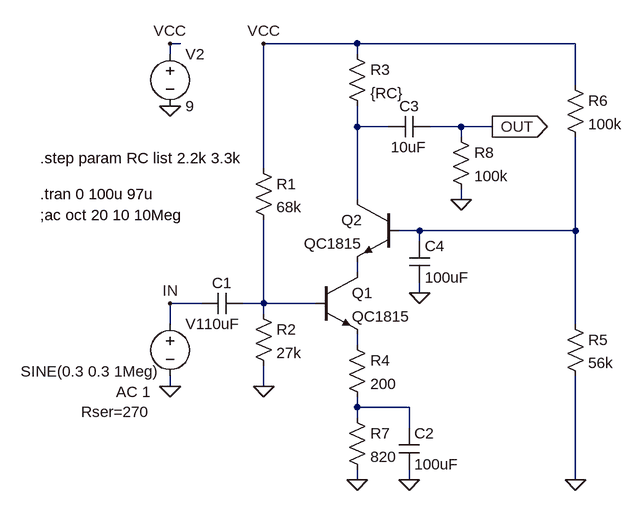
[diagram p0: schematic BaseCommon_Cascode.asc]
BaseCommon_Cascode.asc, the LTspice schematic file:
Version 4
SHEET 1 1048 704
WIRE 80 -64 64 -64
WIRE 352 -64 208 -64
WIRE 688 -64 352 -64
WIRE 64 -48 64 -64
WIRE 352 -48 352 -64
WIRE 688 0 688 -64
WIRE 352 64 352 32
WIRE 400 64 352 64
WIRE 512 64 464 64
WIRE 560 64 512 64
WIRE 512 80 512 64
WIRE 208 128 208 -64
WIRE 352 176 352 64
WIRE 512 176 512 160
WIRE 448 224 416 224
WIRE 688 224 688 80
WIRE 688 224 448 224
WIRE 448 240 448 224
WIRE 352 288 352 272
WIRE 448 320 448 304
WIRE 112 336 64 336
WIRE 208 336 208 208
WIRE 208 336 176 336
WIRE 288 336 208 336
WIRE 208 352 208 336
WIRE 64 368 64 336
WIRE 688 368 688 224
WIRE 352 400 352 384
WIRE 64 464 64 448
WIRE 208 464 208 432
WIRE 352 496 352 480
WIRE 432 496 352 496
WIRE 352 512 352 496
WIRE 432 528 432 496
WIRE 352 608 352 592
WIRE 432 608 432 592
WIRE 688 608 688 448
FLAG 432 608 0
FLAG 208 464 0
FLAG 688 608 0
FLAG 64 464 0
FLAG 64 336 IN
FLAG 560 64 OUT
IOPIN 560 64 Out
FLAG 64 32 0
FLAG 64 -64 VCC
FLAG 208 -64 VCC
FLAG 448 320 0
FLAG 352 608 0
FLAG 512 176 0
SYMBOL npn 416 176 M0
SYMATTR InstName Q2
SYMATTR Value QC1815
SYMBOL res 192 112 R0
SYMATTR InstName R1
SYMATTR Value 68k
SYMBOL res 192 336 R0
SYMATTR InstName R2
SYMATTR Value 27k
SYMBOL cap 416 528 R0
SYMATTR InstName C2
SYMATTR Value 100uF
SYMBOL res 336 -64 R0
SYMATTR InstName R3
SYMATTR Value {RC}
SYMBOL res 336 384 R0
SYMATTR InstName R4
SYMATTR Value 200
SYMBOL res 672 352 R0
SYMATTR InstName R5
SYMATTR Value 56k
SYMBOL cap 176 320 R90
WINDOW 0 0 32 VBottom 2
WINDOW 3 32 32 VTop 2
SYMATTR InstName C1
SYMATTR Value 10uF
SYMBOL voltage 64 352 R0
WINDOW 123 -83 120 Left 2
WINDOW 39 -137 151 Left 2
WINDOW 3 -230 89 Left 2
SYMATTR Value2 AC 1
SYMATTR SpiceLine Rser=270
SYMATTR Value SINE(0.3 0.3 1Meg)
SYMATTR InstName V1
SYMBOL voltage 64 -64 R0
SYMATTR InstName V2
SYMATTR Value 9
SYMBOL npn 288 288 R0
SYMATTR InstName Q1
SYMATTR Value QC1815
SYMBOL cap 432 240 R0
SYMATTR InstName C4
SYMATTR Value 100uF
SYMBOL res 672 -16 R0
SYMATTR InstName R6
SYMATTR Value 100k
SYMBOL res 336 496 R0
SYMATTR InstName R7
SYMATTR Value 820
SYMBOL cap 464 48 R90
WINDOW 0 0 32 VBottom 2
WINDOW 3 32 32 VTop 2
SYMATTR InstName C3
SYMATTR Value 10uF
SYMBOL res 496 64 R0
SYMATTR InstName R8
SYMATTR Value 100k
TEXT -136 168 Left 2 !.tran 0 100u 97u
TEXT -136 200 Left 2 !;ac oct 20 10 10Meg
TEXT -136 112 Left 2 !.step param RC list 2.2k 3.3k

The netlist it stands for:
* BaseCommon_Cascode.asc
Q2 N001 N002 N003 0 QC1815
R1 VCC N004 68k
R2 N004 0 27k
C2 N006 0 100uF
R3 VCC N001 {RC}
R4 N005 N006 200
R5 N002 0 56k
C1 N004 IN 10uF
V1 IN 0 SINE(0.3 0.3 1Meg) AC 1 Rser=270
V2 VCC 0 9
Q1 N003 N004 N005 0 QC1815
C4 N002 0 100uF
R6 VCC N002 100k
R7 N006 0 820
C3 OUT N001 10uF
R8 OUT 0 100k
.model NPN NPN
.model PNP PNP
.lib standard.bjt
.tran 0 100u 97u
;ac oct 20 10 10Meg
.step param RC list 2.2k 3.3k
.backanno
.end